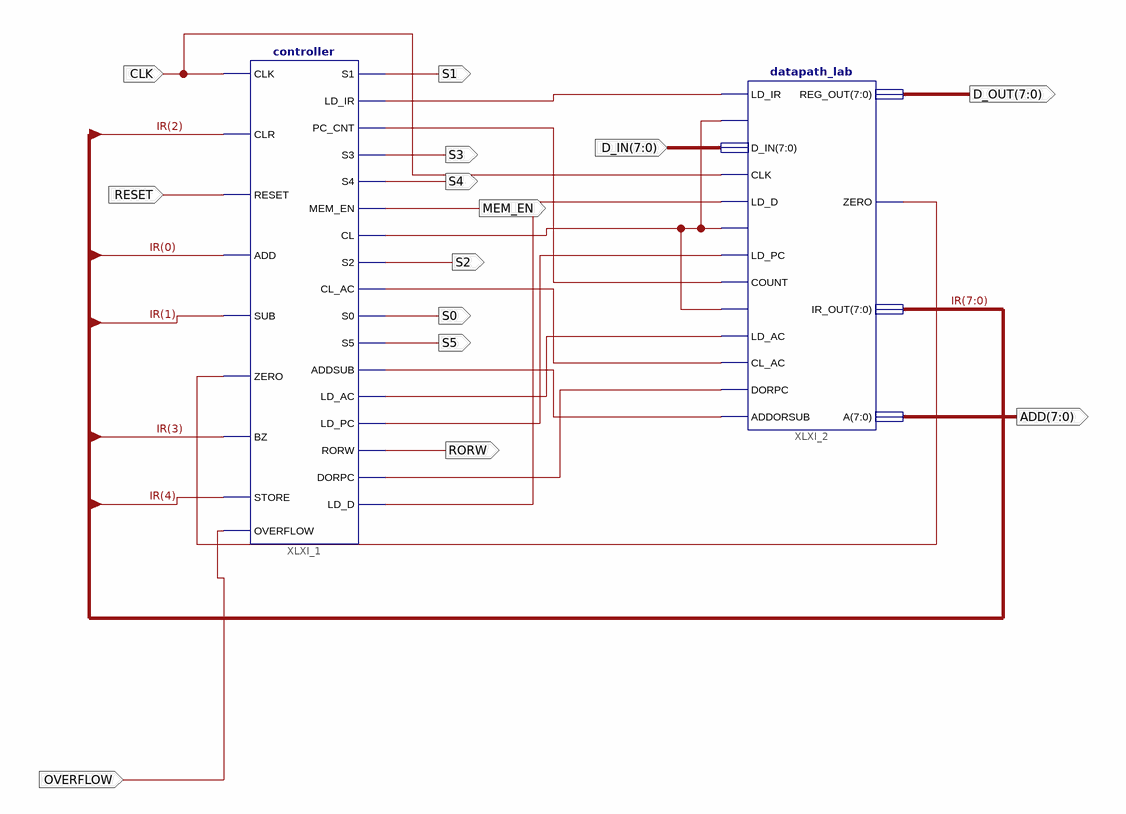
[diagram p0: schematic sheet 1]
// Xilinx ISE schematic toyProcessor.sch (spartan3e) as structural Verilog: 2 symbols, 14 ports
module toyProcessor (
  input  CLK,
  input  RESET,
  input  [7:0] D_IN,
  input  OVERFLOW,
  output S0,
  output S5,
  output S1,
  output S3,
  output S4,
  output S2,
  output [7:0] D_OUT,
  output RORW,
  output MEM_EN,
  output [7:0] ADD
);

  wire XLXN_10, XLXN_11, XLXN_12, XLXN_13, XLXN_14, XLXN_17, XLXN_18, XLXN_20, XLXN_23, XLXN_24;
  wire [7:0] IR;

  controller XLXI_1 (
    .CLK(CLK), .CLR(IR[2]), .RESET(RESET), .ADD(IR[0]), .SUB(IR[1]), .ZERO(XLXN_24), .BZ(IR[3]),
    .STORE(IR[4]), .S1(S1), .LD_IR(XLXN_17), .PC_CNT(XLXN_20), .S3(S3), .S4(S4), .MEM_EN(MEM_EN),
    .CL(XLXN_23), .S2(S2), .CL_AC(XLXN_11), .S0(S0), .S5(S5), .ADDSUB(XLXN_10), .LD_AC(XLXN_12),
    .LD_PC(XLXN_13), .RORW(RORW), .DORPC(XLXN_18), .LD_D(XLXN_14), .OVERFLOW(OVERFLOW));
  datapath_lab XLXI_2 (
    .LD_IR(XLXN_17), .CL_IR(XLXN_23), .D_IN(D_IN), .CLK(CLK), .LD_D(XLXN_14), .CL_D(XLXN_23),
    .LD_PC(XLXN_13), .COUNT(XLXN_20), .CL_PC(XLXN_23), .LD_AC(XLXN_12), .CL_AC(XLXN_11), .DORPC(XLXN_18),
    .ADDORSUB(XLXN_10), .REG_OUT(D_OUT), .ZERO(XLXN_24), .IR_OUT(IR), .A(ADD));
endmodule
